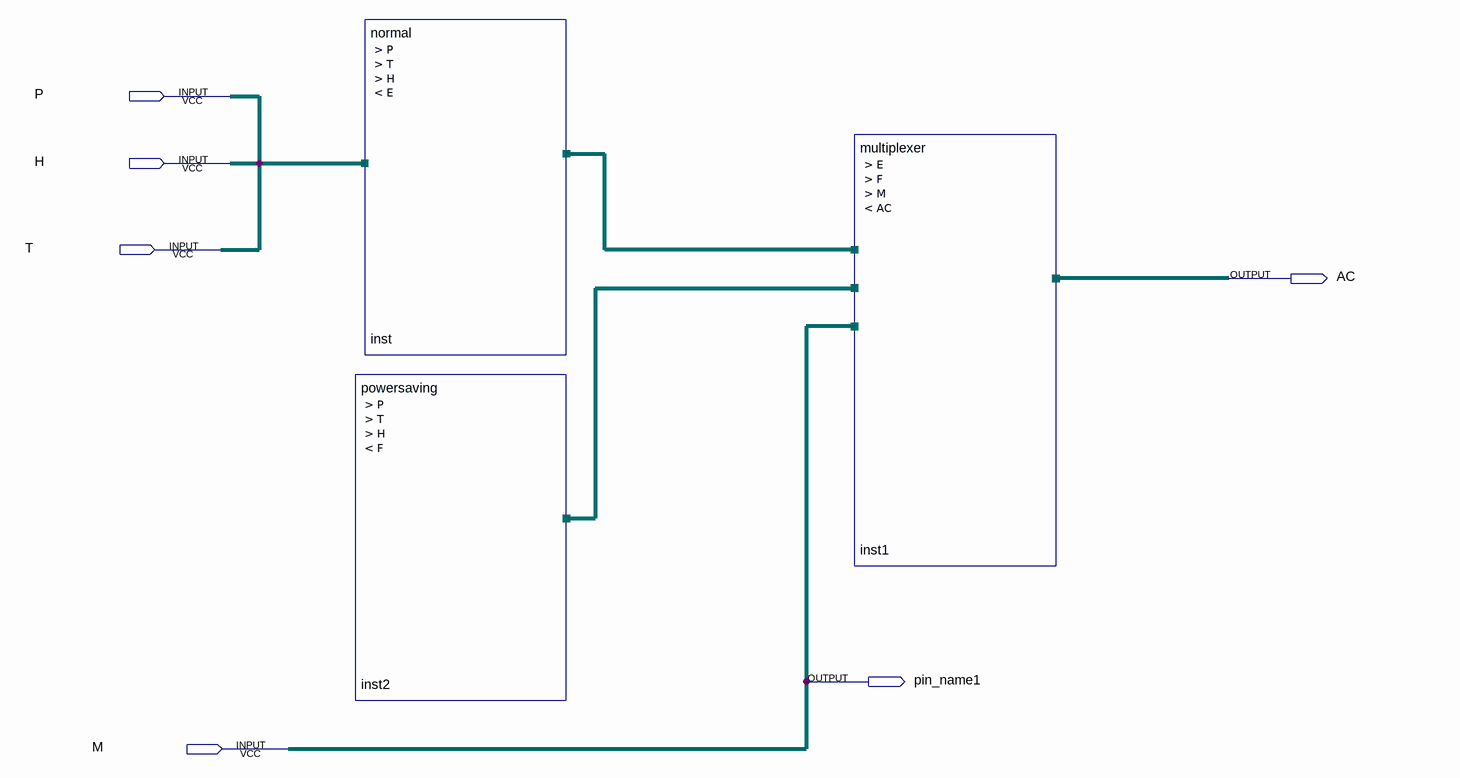
[diagram p0: schematic sheet]
// Quartus schematic lab4step2.bdf as structural Verilog: 3 symbols, 6 pins
module lab4step2 (
  input  P,
  input  H,
  input  T,
  input  M,
  output AC,
  output pin_name1
);

  wire E, F;

  normal inst (.P(P), .T(T), .H(H), .E(E));
  powersaving inst2 (.F(F));  // open: P, T, H
  multiplexer inst1 (.E(E), .F(F), .M(M), .AC(AC));
endmodule
